# EAGLE design CAN-breakout-3.3V-v3 (EAGLE 7.5.0)
DATABASE: /home/monkbroc/Electronics/eagle/PARTSDB.tsv
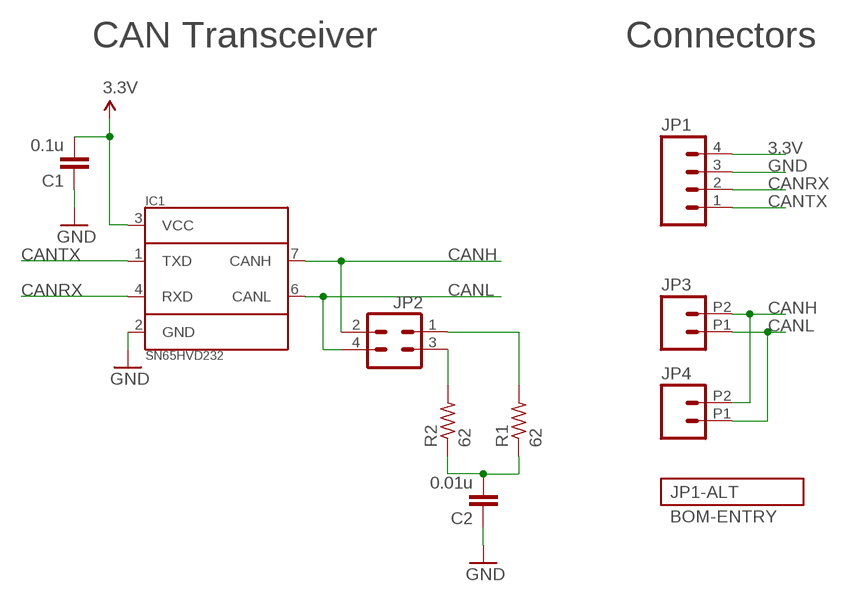
[diagram p0: schematic, sheet 1]
JP1-ALT (BOM-ENTRY): PARTNO: PEC04SBBN

## Parts
C1  0.1u  C-EUC1206  [C1206]
C2  0.01u  C-EUC1206  [C1206]
IC1  SN65HVD232  [SO8]
JP1  M04PTH  [1X04]
JP2  M02X2  [2X2]
JP3  M022.54MM_SCREWTERM  [1X02_2.54_SCREWTERM]
JP4  M022.54MM_SCREWTERM  [1X02_2.54_SCREWTERM]
R1  62  R-US_R1206  [R1206]
R2  62  R-US_R1206  [R1206]

## Nets
3.3V: C1.2 IC1.3(VCC) JP1.4
CANH: IC1.7(CANH) JP2.2 JP3.P2 JP4.P2
CANL: IC1.6(CANL) JP2.4 JP3.P1 JP4.P1
CANRX: IC1.4(RXD) JP1.2
CANTX: IC1.1(TXD) JP1.1
GND: C1.1 C2.1 IC1.2(GND) JP1.3
N$1: JP2.1 R1.2
N$7: C2.2 R1.1 R2.1
N$10: JP2.3 R2.2

## Notes on the sheet
- CAN Transceiver | Connectors

## Library data of the parts
C1 = rcl:C-EU: CAPACITOR, European symbol; PARTNO: 12065C104KAT2A
C2 = rcl:C-EU: CAPACITOR, European symbol; PARTNO: 12065C103KAT2A
IC1 = CAN:SN65HVD232; PARTNO: SN65HVD232DR
JP1 = SparkFun-Connectors:M04: Header 4 Standard 4-pin 0.1" header. Use with straight break away headers (SKU : PRT-00116), right angle break away headers (PRT-00553), swiss pins (PRT-00743), machine pins (PRT-00117), and female headers (PRT-00115). Molex polarized connector foot print use with SKU : PRT-08231 with associated crimp pins and housings. 1MM SMD Version SKU: PRT-10208; PARTNO: PREC004SAAN-RC
JP2 = CAN:M02X2: .1" header, two rows of two.; PARTNO: PREC002DAAN-RC
JP3 JP4 = SparkFun-Connectors:M02: Standard 2-pin 0.1" header. Use with - straight break away headers ( PRT-00116) - right angle break away headers (PRT-00553) - swiss pins (PRT-00743) - machine pins (PRT-00117) - female headers (PRT-00115) Molex polarized connector foot print use with: PRT-08233 with associated crimp pins and housings. 2.54_SCREWTERM for use with PRT-10571. 3.5mm Screw Terminal footprints for PRT-08084 5mm Screw Terminal footprints for use with PRT-08432; PARTNO: OSTVN02A150
R1 R2 = rcl:R-US_: RESISTOR, American symbol; PARTNO: RC1206FR-0762RL

## Net classes
0 default: width 0.254 mm
1 power: width 0.813 mm, clearance 0.406 mm

## Board
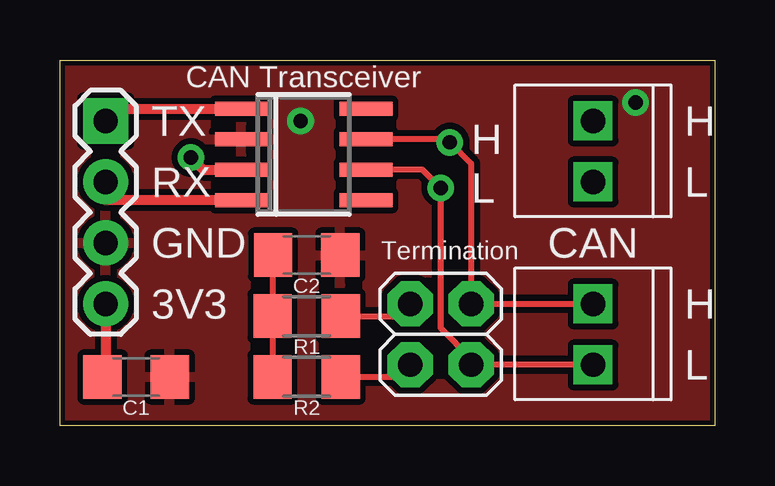
[diagram p1: board, top side]
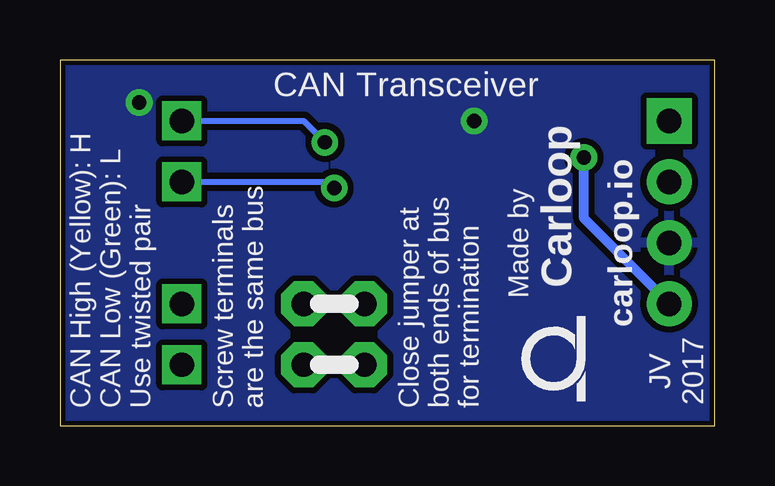
[diagram p2: board, bottom side, seen from below]

Size 27.3 x 15.24 mm. Coordinates in mm from the lower left corner, seen from the top.
Outline: 0,15.24 27.3,15.24 27.3,0 0,0 0,15.24
Copper layers (1*16): Top 0.035mm / dielectric 1.5mm / Bottom 0.035mm
Design rules "SparkFun *": minimum track width 8mil, minimum drill 20mil, track to track 10mil, track to pad 8mil, pad to pad 10mil, via to via 10mil, smd to smd 10mil, copper to edge 8mil, drill to drill 8mil, minimum pad ring 12mil, minimum via ring 10mil, stop-mask expansion 4mil, vias tented up to drill 25mil, thermal gap 10mil

### Footprints (pad centres in the part's own frame; a part is rotated, then mirrored left to right if it is on the bottom)
C1206 = smd 1.6 x 1.8: 1 -1.4,0; 2 1.4,0
SO8 = smd 0.6 x 2.2: 1 -1.905,-2.6; 2 -0.635,-2.6; 3 0.635,-2.6; 4 1.905,-2.6; 5 1.905,2.6; 6 0.635,2.6; 7 -0.635,2.6; 8 -1.905,2.6
1X04 = drill 1.016 pad 1.88 square: 1 0,0 | drill 1.016 pad 1.88: 2 2.54,0; 3 5.08,0; 4 7.62,0
2X2 = drill 1.016 pad 1.88 octagon: 1 0,0; 2 0,2.54; 3 2.54,0; 4 2.54,2.54
1X02_2.54_SCREWTERM = drill 1.016 square: P1 2.54,0; P2 0,0
R1206 = smd 1.6 x 1.803: 1 -1.422,0; 2 1.422,0

### Placement (x,y rotation side)
C1  3.17,2.03 180 top
C2  10.29,7.11 180 top
IC1  10.16,11.3 270 top
JP1  1.91,12.7 270 top
JP2  14.61,5.08 270 top
JP3  22.22,5.08 270 top
JP4  22.22,12.7 270 top
R1  10.29,4.57 0 top
R2  10.29,2.03 0 top

### Tracks (layer width: path | path; a pad name or v marks a point on that pad's centre or on a via)
3.3V  (via drill 0.6)
  Top 0.406: JP1.4 1.91,2.16 C1.2 | v5.46,11.18 5.97,10.67 IC1.3
  Bottom 0.406: JP1.4 5.46,8.64 v5.46,11.18
CANH  (via drill 0.6)
  Top 0.254: v16.26,11.81 17.14,10.92 JP2.2 JP3.P2 | v16.26,11.81 16.13,11.94 15.88,11.94 | 15.88,11.94 IC1.7 | v16.26,11.81 16,11.81 15.88,11.94
  Bottom 0.254: JP4.P2 17.14,12.7 v16.26,11.81
CANL  (via drill 0.6)
  Top 0.254: JP3.P1 JP2.4 17.14,2.79 15.88,4.06 v15.88,9.91 15.49,10.29 15.11,10.67 IC1.6
  Bottom 0.254: JP4.P1 16.13,10.16 v15.88,9.91
CANRX
  Top 0.406: IC1.4 1.91,9.4 JP1.2
CANTX
  Top 0.406: JP1.1 1.91,13.21 IC1.1
GND  (via drill 0.6)
  other vias: 24,13.46 10.03,12.7
  pour Top: 0,15.24 27.3,15.24 27.3,0 0,0
  pour Bottom: 0,15.24 27.3,15.24 27.3,0 0,0
N$1
  Top 0.254: R1.2 14.1,4.57 JP2.1
N$7
  Top 0.254: R1.1 R2.1 | 8.89,4.57 C2.2
  Top 0.406: R1.1 8.89,4.57
N$10
  Top 0.254: R2.2 14.1,2.03 JP2.3

### Text on the board
tPlace: CAN Transceiver | TX | H | H | RX | L | L | GND | Termination | CAN | 3V3 | H | L
bPlace: CAN Transceiver | Carloop | carloop.io | Made by | JV / 2017 | Close jumper at / both ends of bus / for termination | Screw terminals / are the same bus | CAN High (Yellow): H / CAN Low (Green): L / Use twisted pair
bStop: V3
Document: Revision 1 | Julien Vanier | jvanier@gmail.com
tDocu: All components go on top | IC1 | JP4 | (Do not populate) | C2 | JP2 | JP1 | R1 | JP3 | C1 | R2